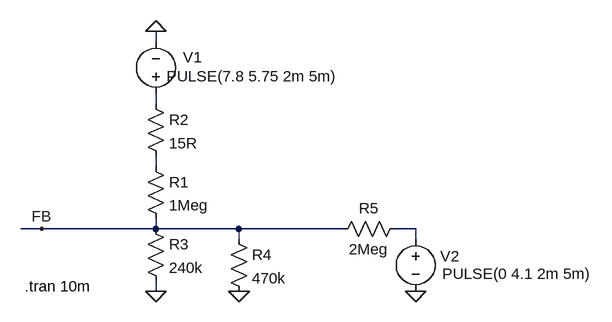
[diagram p0: schematic output-voltage.asc]
output-voltage.asc, the LTspice schematic file:
Version 4
SHEET 1 944 680
WIRE 272 -96 272 -112
WIRE 272 0 272 -16
WIRE 272 96 272 80
WIRE 96 192 64 192
WIRE 272 192 272 176
WIRE 272 192 96 192
WIRE 400 192 272 192
WIRE 560 192 400 192
WIRE 672 192 640 192
WIRE 400 208 400 192
WIRE 672 208 672 192
WIRE 272 288 272 272
FLAG 272 288 0
FLAG 272 -112 0
FLAG 96 192 FB
FLAG 400 288 0
FLAG 672 288 0
SYMBOL res 256 80 R0
SYMATTR InstName R1
SYMATTR Value 1Meg
SYMBOL res 256 -16 R0
SYMATTR InstName R2
SYMATTR Value 15R
SYMBOL res 256 176 R0
SYMATTR InstName R3
SYMATTR Value 240k
SYMBOL voltage 272 0 R180
WINDOW 0 -71 72 Left 2
WINDOW 3 -280 43 Left 2
WINDOW 123 0 0 Left 2
WINDOW 39 0 0 Left 2
SYMATTR InstName V1
SYMATTR Value PULSE(7.8 5.75 2m 5m)
SYMBOL res 384 192 R0
SYMATTR InstName R4
SYMATTR Value 470k
SYMBOL res 656 176 R90
WINDOW 0 0 56 VBottom 2
WINDOW 3 32 56 VTop 2
SYMATTR InstName R5
SYMATTR Value 2Meg
SYMBOL voltage 672 192 R0
WINDOW 0 38 42 Left 2
WINDOW 3 41 69 Left 2
WINDOW 123 0 0 Left 2
WINDOW 39 0 0 Left 2
SYMATTR InstName V2
SYMATTR Value PULSE(0 4.1 2m 5m)
TEXT 70 280 Left 2 !.tran 10m

The netlist it stands for:
* output-voltage.asc
R1 N002 FB 1Meg
R2 N001 N002 15R
R3 FB 0 240k
V1 N001 0 PULSE(7.8 5.75 2m 5m)
R4 FB 0 470k
R5 N003 FB 2Meg
V2 N003 0 PULSE(0 4.1 2m 5m)
.tran 10m
.backanno
.end